# EAGLE design board (EAGLE 8.5.2)
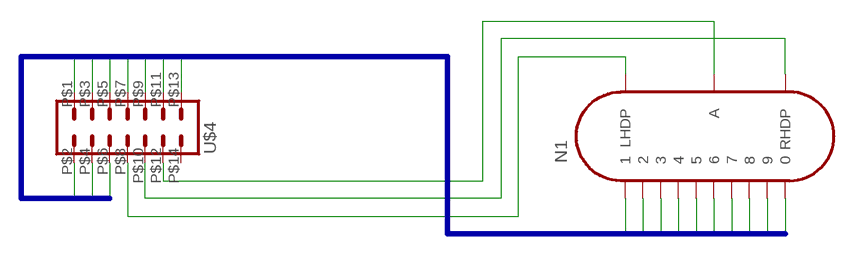
[diagram p0: schematic, sheet 1]

## Parts
N1  IN-14  [IN-14]
U$4  PIN_HEADER_MALE_2X07_14P  [PIN_HEADER_MALE_2X07_14P]

## Nets
N$1: N1.A U$4.P$12
N$2: N1.LHDP U$4.P$8
N$3: N1.RHDP U$4.P$10
NIXIE0: N1.0 U$4.P$1
NIXIE1: N1.1 U$4.P$3
NIXIE2: N1.2 U$4.P$5
NIXIE3: N1.3 U$4.P$7
NIXIE4: N1.4 U$4.P$9
NIXIE5: N1.5 U$4.P$11
NIXIE6: N1.6 U$4.P$13
NIXIE7: N1.7 U$4.P$2
NIXIE8: N1.8 U$4.P$4
NIXIE9: N1.9 U$4.P$6
Unconnected: U$4.P$14

## Buses
NIXIE[0..9]

## Library data of the parts
N1 = russian-nixies:IN-14: IN-14: medium numeric frontview nixie tube
U$4 = 160713 Library by matsu:PIN_HEADER_MALE_2X07_14P

## Net classes
0 default: width 0.508 mm, clearance 0.254 mm

## Board
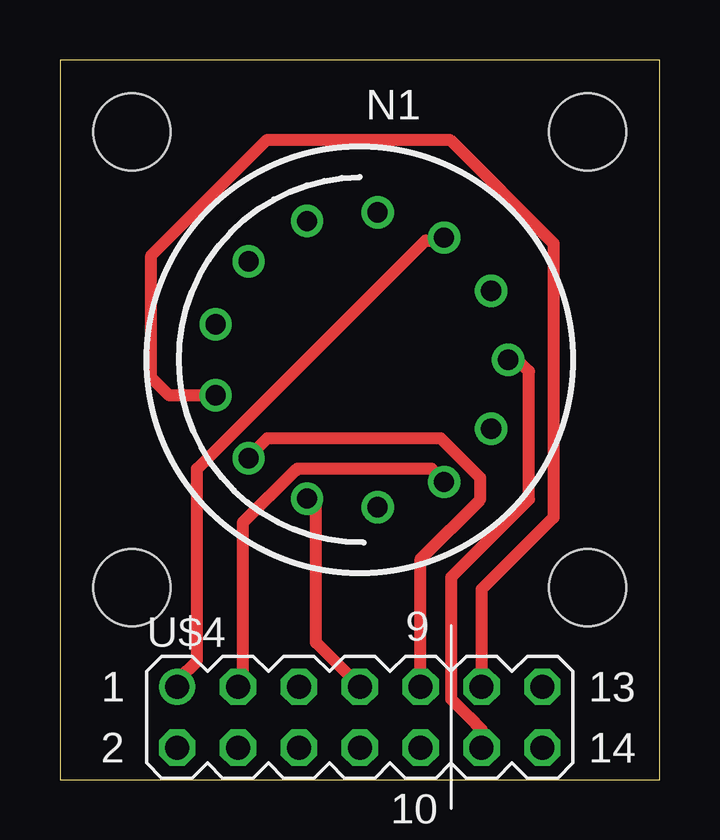
[diagram p1: board, top side]
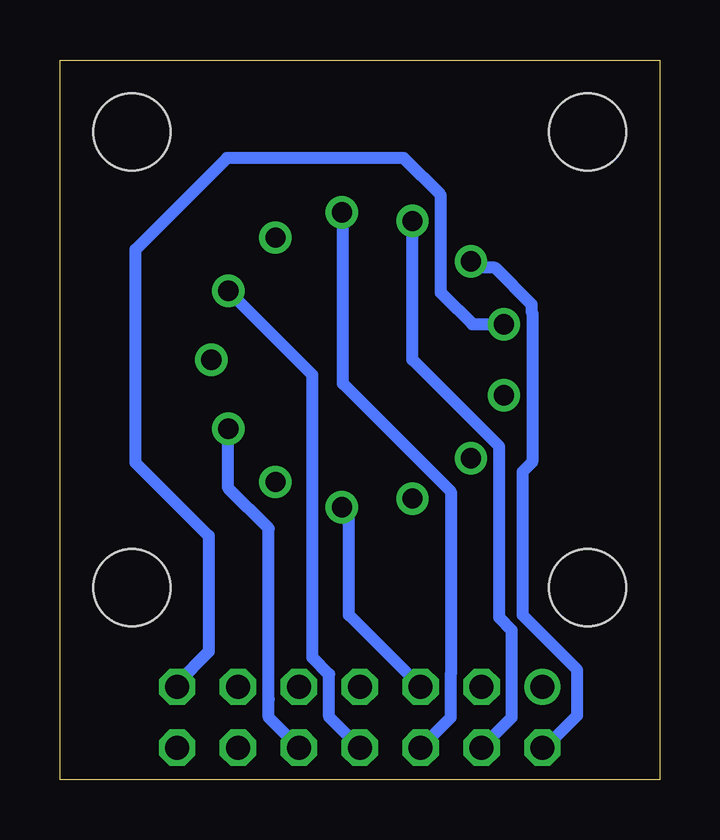
[diagram p2: board, bottom side, seen from below]

Size 25 x 30 mm. Coordinates in mm from the lower left corner, seen from the top.
Outline: 0,0 25,0 25,30 0,30 0,0
Copper layers (1*16): Top 0.035mm / dielectric 1.5mm / Bottom 0.035mm
Design rules "Elecrow_2-layer_eagle_rule": minimum track width 6mil, minimum drill 12mil, track to track 6mil, track to pad 6mil, pad to pad 6mil, via to via 6mil, smd to smd 0mil, copper to edge 10mil, drill to drill 10mil, minimum pad ring 10mil, minimum via ring 6mil, stop-mask expansion 2mil, vias tented up to drill 100mil, thermal gap 10mil
Holes 3.2 mm at 3,27 22,27 22,8 3,8

### Footprints (pad centres in the part's own frame; a part is rotated, then mirrored left to right if it is on the bottom)
IN-14 = drill 0.84: 0 5.094,-3.516; 1 -5.094,-3.516; 2 -6.145,-0.746; 3 -5.788,2.195; 4 -4.105,4.633; 5 -1.481,6.01; 6 1.481,6.01; 7 4.105,4.633; 8 5.788,2.195; 9 6.145,-0.746; A 0,-6.19; LHDP 2.877,-5.481; RHDP -2.877,-5.481
PIN_HEADER_MALE_2X07_14P = drill 1: P$1 -7.62,1.27 | drill 1 octagon: P$2 -7.62,-1.27; P$3 -5.08,1.27; P$4 -5.08,-1.27; P$5 -2.54,1.27; P$6 -2.54,-1.27; P$7 0,1.27; P$8 0,-1.27; P$9 2.54,1.27; P$10 2.54,-1.27; P$11 5.08,1.27; P$12 5.08,-1.27; P$13 7.62,1.27; P$14 7.62,-1.27

### Placement (x,y rotation side)
N1  12.5,17.5 90 top
U$4  12.5,2.6 0 top

### Tracks (layer width: path | path; a pad name or v marks a point on that pad's centre or on a via)
N$1
  Top 0.508: U$4.P$12 17.58,2.09 17.06,2.61 16.32,3.35 16.32,8.44 19.56,11.68 19.56,17.02 19.08,17.5 N1.A
N$2
  Bottom 0.508: N1.LHDP 14.48,16.87 14.48,5.09 13.78,4.39 13.78,2.61 U$4.P$8
N$3
  Bottom 0.508: U$4.P$10 16.3,2.59 16.3,3.34 16.3,3.35 16.3,10.46 17.98,12.14 N1.RHDP
NIXIE0
  Top 0.508: N1.0 16,22.48 15.24,22.48 5.71,12.95 5.71,4.95 4.95,4.19 U$4.P$1
NIXIE1
  Top 0.508: U$4.P$3 7.62,4.19 7.62,10.7 9.81,12.89 9.85,12.89 9.91,12.95 15.49,12.95 16.02,12.43 N1.1
NIXIE2
  Bottom 0.508: N1.2 12.95,11.05 12.95,6.86 10.29,4.19 U$4.P$5
NIXIE3
  Top 0.508: N1.3 10.67,11.43 10.67,5.71 12.19,4.19 U$4.P$7
NIXIE4
  Top 0.508: U$4.P$9 15.04,9.2 17.53,11.68 17.53,12.57 15.88,14.22 8.64,14.22 7.87,13.46 N1.4
NIXIE5
  Top 0.508: N1.5 4.55,16.02 3.81,16.76 3.81,21.84 8.64,26.67 16.26,26.67 20.57,22.35 20.57,10.92 17.58,7.93 U$4.P$11
NIXIE6
  Bottom 0.508: N1.6 7.8,18.98 9.01,20.18 9.12,20.3 9.12,24.36 10.67,25.91 18.03,25.91 21.84,22.1 21.84,13.21 18.8,10.16 18.8,5.33 20.12,4.01 U$4.P$13
NIXIE7
  Bottom 0.508: N1.7 7.62,21.34 6.86,21.34 5.33,19.81 5.33,19.5 5.31,19.47 5.31,13.23 5.71,12.83 5.71,6.86 3.43,4.57 3.43,2.67 4.57,1.52 U$4.P$2
NIXIE8
  Bottom 0.508: U$4.P$4 6.16,2.59 6.16,3.34 6.16,3.35 6.16,6.22 6.68,6.75 6.68,13.88 10.3,17.5 N1.8
NIXIE9
  Bottom 0.508: N1.9 13.21,23.61 13.21,16.51 8.7,12 8.7,4.4 8.7,4.39 8.7,2.59 U$4.P$6